# Altium schematic sheet main.SchDoc
size A4
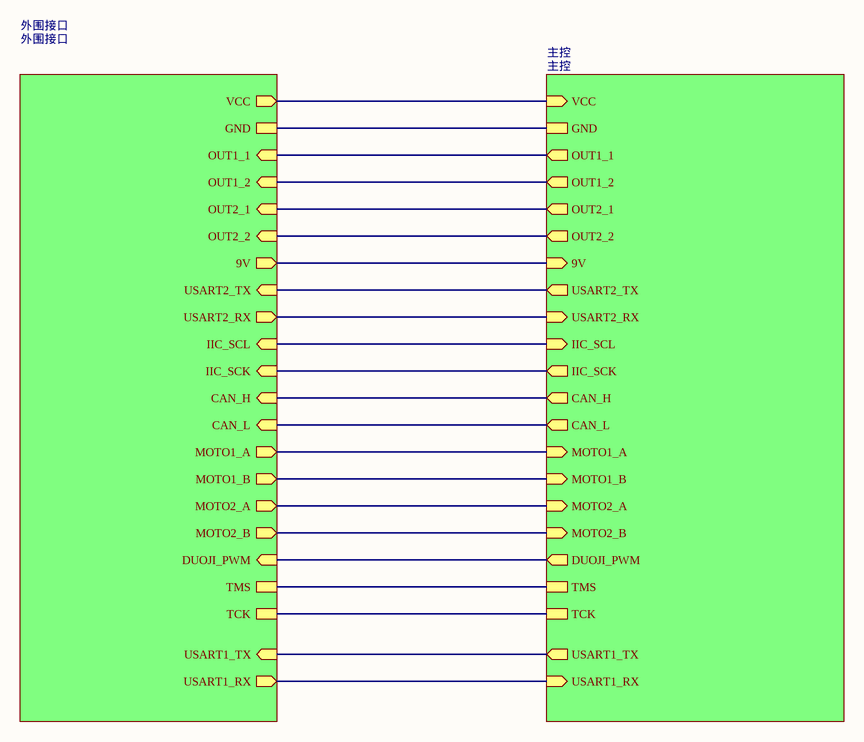
[diagram p0: main.SchDoc]

## Sub-sheets
主控 = 主控: VCC (in), GND, OUT1_1 (out), OUT1_2 (out), OUT2_1 (out), OUT2_2 (out), 9V (in), USART2_TX (out), USART2_RX (in), IIC_SCL (in), IIC_SCK (out), CAN_H (out), CAN_L (out), MOTO1_A (in), MOTO1_B (in), MOTO2_A (in), MOTO2_B (in), DUOJI_PWM (out), TMS, TCK, USART1_TX (out), USART1_RX (in)
外围接口 = 外围接口: VCC (out), GND, OUT1_1 (in), OUT1_2 (in), OUT2_1 (in), OUT2_2 (in), 9V (out), USART2_TX (in), USART2_RX (out), IIC_SCL (in), IIC_SCK (in), CAN_H (in), CAN_L (in), MOTO1_A (out), MOTO1_B (out), MOTO2_A (out), MOTO2_B (out), DUOJI_PWM (in), TMS, TCK, USART1_TX (in), USART1_RX (out)

## Nets
(unnamed): sheet 外围接口/VCC, sheet 主控/VCC
(unnamed): sheet 外围接口/GND, sheet 主控/GND
(unnamed): sheet 外围接口/OUT1_1, sheet 主控/OUT1_1
(unnamed): sheet 外围接口/OUT1_2, sheet 主控/OUT1_2
(unnamed): sheet 外围接口/OUT2_1, sheet 主控/OUT2_1
(unnamed): sheet 外围接口/OUT2_2, sheet 主控/OUT2_2
(unnamed): sheet 外围接口/9V, sheet 主控/9V
(unnamed): sheet 外围接口/USART2_TX, sheet 主控/USART2_TX
(unnamed): sheet 外围接口/USART2_RX, sheet 主控/USART2_RX
(unnamed): sheet 外围接口/IIC_SCL, sheet 主控/IIC_SCL
(unnamed): sheet 外围接口/IIC_SCK, sheet 主控/IIC_SCK
(unnamed): sheet 外围接口/CAN_H, sheet 主控/CAN_H
(unnamed): sheet 外围接口/CAN_L, sheet 主控/CAN_L
(unnamed): sheet 外围接口/MOTO1_A, sheet 主控/MOTO1_A
(unnamed): sheet 外围接口/MOTO1_B, sheet 主控/MOTO1_B
(unnamed): sheet 外围接口/MOTO2_A, sheet 主控/MOTO2_A
(unnamed): sheet 外围接口/MOTO2_B, sheet 主控/MOTO2_B
(unnamed): sheet 外围接口/DUOJI_PWM, sheet 主控/DUOJI_PWM
(unnamed): sheet 外围接口/TMS, sheet 主控/TMS
(unnamed): sheet 外围接口/TCK, sheet 主控/TCK
(unnamed): sheet 外围接口/USART1_TX, sheet 主控/USART1_TX
(unnamed): sheet 外围接口/USART1_RX, sheet 主控/USART1_RX